# EAGLE design led_arrays (EAGLE 6.1)
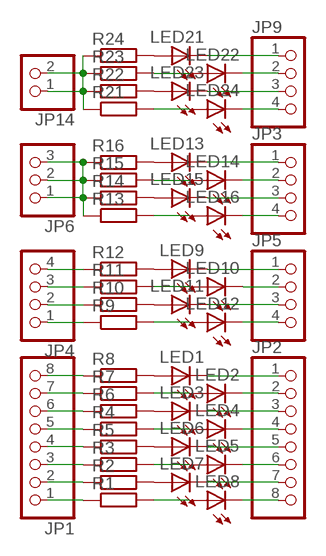
[diagram p0: schematic, sheet 1]

## Parts
JP1  PINHD-1X8  [1X08]
JP2  PINHD-1X8  [1X08]
JP3  PINHD-1X4  [1X04]
JP4  PINHD-1X4  [1X04]
JP5  PINHD-1X4  [1X04]
JP6  PINHD-1X3  [1X03]
JP9  PINHD-1X4  [1X04]
JP14  PINHD-1X2  [1X02]
LED1  LEDSML0805  [SML0805]
LED2  LEDSML0805  [SML0805]
LED3  LEDSML0805  [SML0805]
LED4  LEDSML0805  [SML0805]
LED5  LEDSML0805  [SML0805]
LED6  LEDSML0805  [SML0805]
LED7  LEDSML0805  [SML0805]
LED8  LEDSML0805  [SML0805]
LED9  LEDSML0805  [SML0805]
LED10  LEDSML0805  [SML0805]
LED11  LEDSML0805  [SML0805]
LED12  LEDSML0805  [SML0805]
LED13  LEDSML0805  [SML0805]
LED14  LEDSML0805  [SML0805]
LED15  LEDSML0805  [SML0805]
LED16  LEDSML0805  [SML0805]
LED21  LEDSML0805  [SML0805]
LED22  LEDSML0805  [SML0805]
LED23  LEDSML0805  [SML0805]
LED24  LEDSML0805  [SML0805]
R1  R-EU_M0805  [M0805]
R2  R-EU_M0805  [M0805]
R3  R-EU_M0805  [M0805]
R4  R-EU_M0805  [M0805]
R5  R-EU_M0805  [M0805]
R6  R-EU_M0805  [M0805]
R7  R-EU_M0805  [M0805]
R8  R-EU_M0805  [M0805]
R9  R-EU_M0805  [M0805]
R10  R-EU_M0805  [M0805]
R11  R-EU_M0805  [M0805]
R12  R-EU_M0805  [M0805]
R13  R-EU_M0805  [M0805]
R14  R-EU_M0805  [M0805]
R15  R-EU_M0805  [M0805]
R16  R-EU_M0805  [M0805]
R21  R-EU_M0805  [M0805]
R22  R-EU_M0805  [M0805]
R23  R-EU_M0805  [M0805]
R24  R-EU_M0805  [M0805]

## Nets
N$1: JP1.8 R8.1
N$2: JP1.7 R7.1
N$3: JP1.6 R6.1
N$4: JP1.4 R5.1
N$5: JP1.5 R4.1
N$6: JP1.3 R3.1
N$7: JP1.2 R2.1
N$8: JP1.1 R1.1
N$9: LED1.A R8.2
N$10: LED2.A R7.2
N$11: LED3.A R6.2
N$12: LED4.A R4.2
N$13: LED6.A R5.2
N$14: LED5.A R3.2
N$15: LED7.A R2.2
N$16: LED8.A R1.2
N$17: JP2.2 LED2.C
N$18: JP2.4 LED4.C
N$19: JP2.6 LED5.C
N$20: JP2.8 LED8.C
N$21: JP2.1 LED1.C
N$22: JP2.3 LED3.C
N$23: JP2.5 LED6.C
N$24: JP2.7 LED7.C
N$25: LED9.A R12.2
N$26: LED10.A R11.2
N$27: LED11.A R10.2
N$28: LED12.A R9.2
N$29: JP5.1 LED9.C
N$30: JP5.3 LED11.C
N$33: LED13.A R16.2
N$34: LED15.A R14.2
N$37: JP3.2 LED14.C
N$38: JP3.4 LED16.C
N$41: JP4.1 R9.1
N$42: JP4.2 R10.1
N$43: JP4.3 R11.1
N$44: JP4.4 R12.1
N$45: JP6.1 JP6.2 JP6.3 R13.1 R14.1 R15.1 R16.1
N$46: LED14.A R15.2
N$47: JP5.2 LED10.C
N$48: JP5.4 LED12.C
N$49: JP3.3 LED15.C
N$50: JP3.1 LED13.C
N$51: LED16.A R13.2
N$54: LED21.A R24.2
N$58: LED23.A R22.2
N$61: JP9.2 LED22.C
N$62: JP9.4 LED24.C
N$63: JP14.1 JP14.2 R21.1 R22.1 R23.1 R24.1
N$64: LED22.A R23.2
N$65: JP9.3 LED23.C
N$66: JP9.1 LED21.C
N$67: LED24.A R21.2

## Library data of the parts
JP1 JP2 = pinhead:PINHD-1X8: PIN HEADER
JP3-JP5 JP9 = pinhead:PINHD-1X4: PIN HEADER
JP6 = pinhead:PINHD-1X3: PIN HEADER
JP14 = pinhead:PINHD-1X2: PIN HEADER
LED1-LED16 LED21-LED24 = led:LED: LED OSRAM: - CHIPLED LG R971, LG N971, LY N971, LG Q971, LY Q971, LO R971, LY R971 LH N974, LH R974 LS Q976, LO Q976, LY Q976 LO Q996 - Hyper CHIPLED LW Q18S LB Q993, LB Q99A, LB R99A - SideLED LS A670, LO A670, LY A670, LG A670, LP A670 LB A673, LV A673, LT A673, LW A673 LH A674 LY A675 LS A676, LA A676, LO A676, LY A676, LW A676 LS A679, LY A679, LG A679 - Hyper Micro SIDELED® LS Y876, LA Y876, LO Y876, LY Y876 LT Y87S - SmartLED LW L88C, LW L88S LB L89C, LB L89S, LG L890 LS L89K, LO L89K, LY L89K LS L896, LA L896, LO L896, LY L896 - TOPLED LS T670, LO T670, LY T670, LG T670, LP T670 LSG T670, LSP T670, LSY T670, LOP T670, LYG T670 LG T671, LOG T671, LSG T671 LB T673, LV T673, LT T673, LW T673 LH T674 LS T676, LA T676, LO T676, LY T676, LB T676, LH T676, LSB T676, LW T676 LB T67C, LV T67C, LT T67C, LS T67K, LO T67K, LY T67K, LW E67C LS E67B, LA E67B, LO E67B, LY E67B, LB E67C, LV E67C, LT E67C LW T67C LS T679, LY T679, LG T679 LS T770, LO T770, LY T770, LG T770, LP T770 LB T773, LV T773, LT T773, LW T773 LH T774 LS E675, LA E675, LY E675, LS T675 LS T776, LA T776, LO T776, LY T776, LB T776 LHGB T686 LT T68C, LB T68C - Hyper Mini TOPLED® LB M676 - Mini TOPLED Santana® LG M470 LS M47K, LO M47K, LY M47K Source: http://www.osram.convergy.de LUXEON: - LUMILED® LXK2-PW12-R00, LXK2-PW12-S00, LXK2-PW14-U00, LXK2-PW14-V00 LXK2-PM12-R00, LXK2-PM12-S00, LXK2-PM14-U00 LXK2-PE12-Q00, LXK2-PE12-R00, LXK2-PE12-S00, LXK2-PE14-T00, LXK2-PE14-U00 LXK2-PB12-K00, LXK2-PB12-L00, LXK2-PB12-M00, LXK2-PB14-N00, LXK2-PB14-P00, LXK2-PB14-Q00 LXK2-PR12-L00, LXK2-PR12-M00, LXK2-PR14-Q00, LXK2-PR14-R00 LXK2-PD12-Q00, LXK2-PD12-R00, LXK2-PD12-S00 LXK2-PH12-R00, LXK2-PH12-S00 LXK2-PL12-P00, LXK2-PL12-Q00, LXK2-PL12-R00 Source: www.luxeon.com KINGBRIGHT: KA-3528ASYC Source: www.kingbright.com
R1-R16 R21-R24 = rcl:R-EU_: RESISTOR, European symbol

## Board
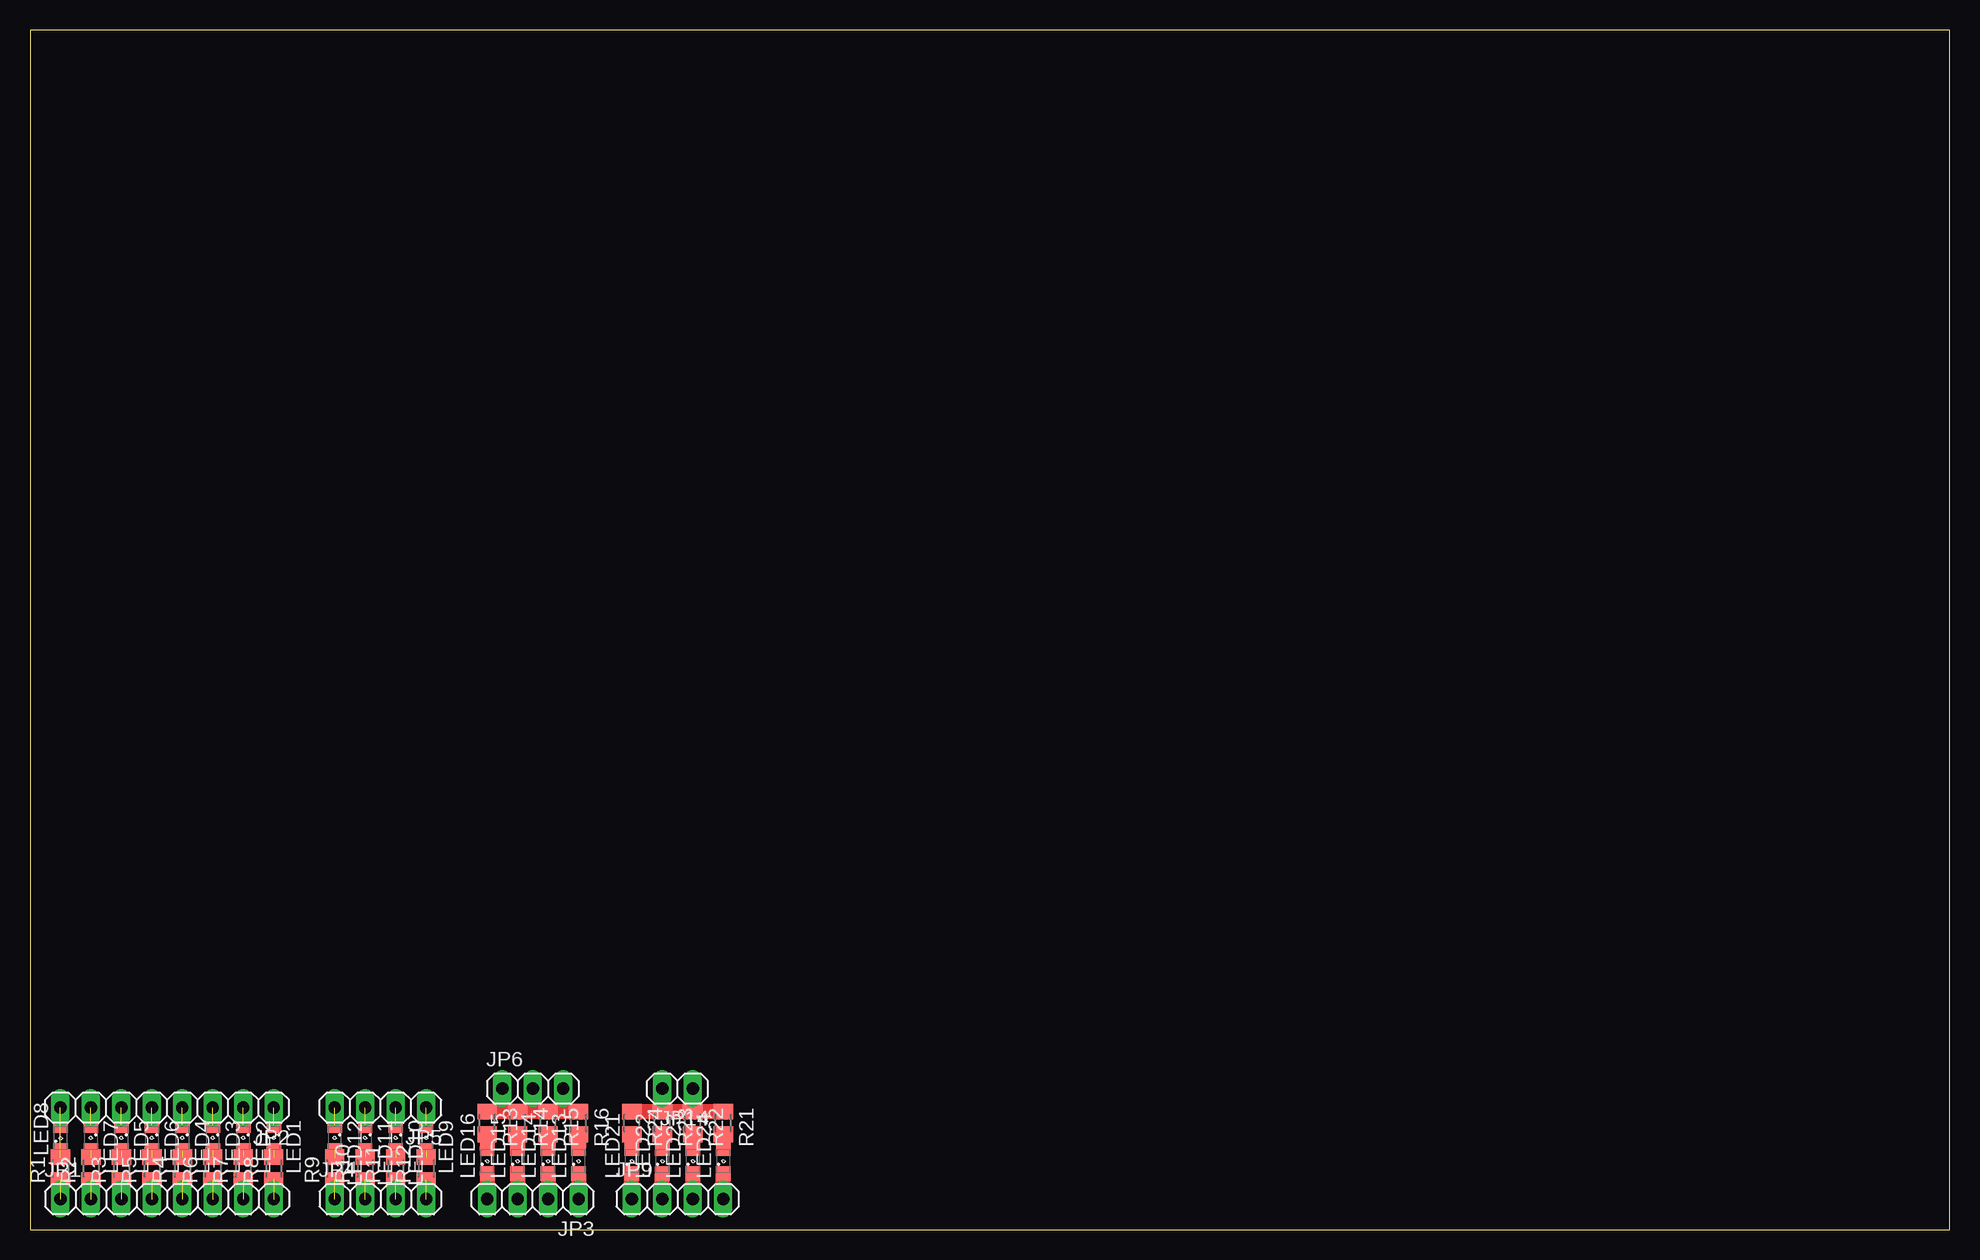
[diagram p1: board, top side]

Size 160 x 100 mm. Coordinates in mm from the lower left corner, seen from the top.
Outline: 0,0 160,0 160,100 0,100 0,0
Copper layers (1*16): Top 0.035mm / dielectric 1.5mm / Bottom 0.035mm
Design rules: minimum track width 10mil, minimum drill 24mil, track to track 8mil, track to pad 8mil, pad to pad 8mil, via to via 8mil, smd to smd 8mil, copper to edge 40mil, drill to drill 8mil, minimum pad ring 10mil, minimum via ring 8mil, stop-mask expansion 4mil, vias tented up to drill 0mil, thermal gap 10mil

### Footprints (pad centres in the part's own frame; a part is rotated, then mirrored left to right if it is on the bottom)
1X08 = drill 1.016 long: 1 -8.89,0; 2 -6.35,0; 3 -3.81,0; 4 -1.27,0; 5 1.27,0; 6 3.81,0; 7 6.35,0; 8 8.89,0
1X04 = drill 1.016 long: 1 -3.81,0; 2 -1.27,0; 3 1.27,0; 4 3.81,0
1X03 = drill 1.016 long: 1 -2.54,0; 2 0,0; 3 2.54,0
1X02 = drill 1.016 long: 1 -1.27,0; 2 1.27,0
SML0805 = smd 1.2 x 1.2: A 1.05,0; C -1.05,0
M0805 = smd 1.3 x 1.6: 1 -0.95,0; 2 0.95,0

### Placement (x,y rotation side)
JP1  11.43,2.54 0 top
JP2  11.43,10.16 180 top
JP3  41.91,2.54 180 top
JP4  29.21,2.54 0 top
JP5  29.21,10.16 180 top
JP6  41.91,11.75 0 top
JP9  53.98,2.54 0 top
JP14  53.98,11.75 180 top
LED1  20.32,7.62 270 top
LED2  17.78,7.62 270 top
LED3  15.24,7.62 270 top
LED4  12.7,7.62 270 top
LED5  7.62,7.62 270 top
LED6  10.16,7.62 270 top
LED7  5.08,7.62 270 top
LED8  2.54,7.62 90 top
LED9  33.02,7.62 270 top
LED10  30.48,7.62 270 top
LED11  27.94,7.62 270 top
LED12  25.4,7.62 270 top
LED13  45.72,5.71 90 top
LED14  43.18,5.71 90 top
LED15  40.64,5.71 90 top
LED16  38.1,5.71 90 top
LED21  50.16,5.71 90 top
LED22  52.7,5.71 90 top
LED23  55.24,5.71 90 top
LED24  57.78,5.71 90 top
R1  2.54,5.08 90 top
R2  5.08,5.08 90 top
R3  7.62,5.08 90 top
R4  12.7,5.08 90 top
R5  10.16,5.08 90 top
R6  15.24,5.08 90 top
R7  17.78,5.08 90 top
R8  20.32,5.08 90 top
R9  25.4,5.08 90 top
R10  27.94,5.08 90 top
R11  30.48,5.08 90 top
R12  33.02,5.08 90 top
R13  38.1,8.89 270 top
R14  40.64,8.89 270 top
R15  43.18,8.89 270 top
R16  45.72,8.89 270 top
R21  57.78,8.89 270 top
R22  55.24,8.89 270 top
R23  52.7,8.89 270 top
R24  50.16,8.89 270 top

### Tracks (layer width: path | path; a pad name or v marks a point on that pad's centre or on a via)
N$1  (1 unrouted)
N$2  (1 unrouted)
N$3  (1 unrouted)
N$4  (1 unrouted)
N$5  (1 unrouted)
N$6  (1 unrouted)
N$7  (1 unrouted)
N$8  (1 unrouted)
N$9  (1 unrouted)
N$10  (1 unrouted)
N$11  (1 unrouted)
N$12  (1 unrouted)
N$13  (1 unrouted)
N$14  (1 unrouted)
N$15  (1 unrouted)
N$16  (1 unrouted)
N$17  (1 unrouted)
N$18  (1 unrouted)
N$19  (1 unrouted)
N$20  (1 unrouted)
N$21  (1 unrouted)
N$22  (1 unrouted)
N$23  (1 unrouted)
N$24  (1 unrouted)
N$25  (1 unrouted)
N$26  (1 unrouted)
N$27  (1 unrouted)
N$28  (1 unrouted)
N$29  (1 unrouted)
N$30  (1 unrouted)
N$33
  Top 1.27: R16.2 LED13.A
N$34
  Top 1.27: R14.2 LED15.A
N$37
  Top 1.27: LED14.C JP3.2
N$38
  Top 1.27: LED16.C JP3.4
N$41  (1 unrouted)
N$42  (1 unrouted)
N$43  (1 unrouted)
N$44  (1 unrouted)
N$45
  Top 1.27: R13.1 39.37,9.84 | 39.37,9.84 R14.1 41.91,9.84 | 41.91,9.84 R15.1 44.45,9.84 | 44.45,9.84 R16.1 | JP6.3 44.45,9.84 | JP6.2 41.91,9.84 | JP6.1 39.37,9.84
N$46
  Top 1.27: R15.2 LED14.A
N$47  (1 unrouted)
N$48  (1 unrouted)
N$49
  Top 1.27: LED15.C JP3.3
N$50
  Top 1.27: LED13.C JP3.1
N$51
  Top 1.27: R13.2 LED16.A
N$54
  Top 1.27: R24.2 LED21.A
N$58
  Top 1.27: R22.2 LED23.A
N$61
  Top 1.27: JP9.2 LED22.C
N$62
  Top 1.27: JP9.4 LED24.C
N$63
  Top 1.27: R24.1 R23.1 | R23.1 R22.1 | R22.1 R21.1 | R22.1 JP14.1 | R23.1 JP14.2
N$64
  Top 1.27: R23.2 LED22.A
N$65
  Top 1.27: LED23.C JP9.3
N$66
  Top 1.27: JP9.1 LED21.C
N$67
  Top 1.27: R21.2 LED24.A